# EAGLE design UPbrdEDP (EAGLE 8.6.0)
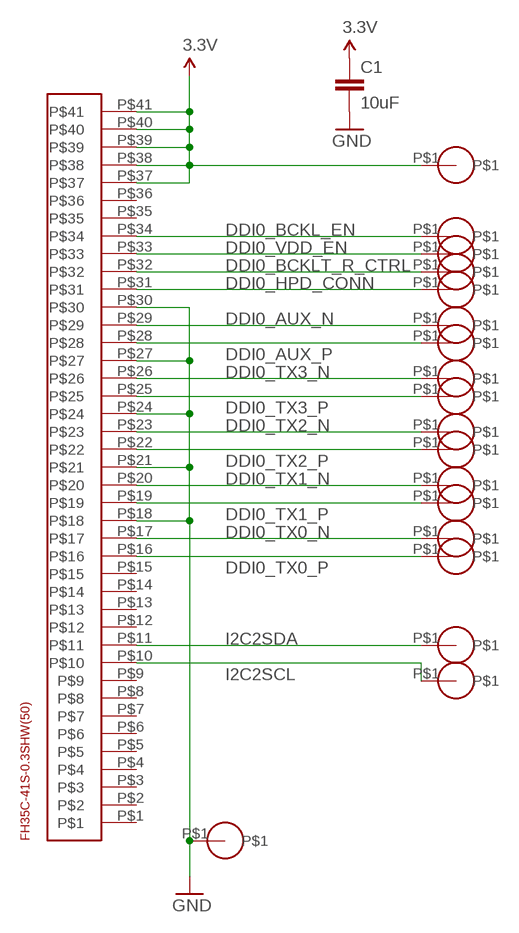
[diagram p0: schematic, sheet 1]

## Parts
C1  10uF  10UF-6.3V-20%(0603)  [0603-CAP]
U$1  FH35C-41S-0.3SHW(50)  [FH35C-41S-0.3SHW(50)]
U$2  SOLDERPAD  [SOLDERPAD]
U$3  SOLDERPAD  [SOLDERPAD]
U$4  SOLDERPAD  [SOLDERPAD]
U$5  SOLDERPAD  [SOLDERPAD]
U$6  SOLDERPAD  [SOLDERPAD]
U$7  SOLDERPAD  [SOLDERPAD]
U$8  SOLDERPAD  [SOLDERPAD]
U$9  SOLDERPAD  [SOLDERPAD]
U$10  SOLDERPAD  [SOLDERPAD]
U$11  SOLDERPAD  [SOLDERPAD]
U$12  SOLDERPAD  [SOLDERPAD]
U$13  SOLDERPAD  [SOLDERPAD]
U$14  SOLDERPAD  [SOLDERPAD]
U$15  SOLDERPAD  [SOLDERPAD]
U$16  SOLDERPAD  [SOLDERPAD]
U$17  SOLDERPAD  [SOLDERPAD]
U$18  SOLDERPAD  [SOLDERPAD]
U$19  SOLDERPAD  [SOLDERPAD]

## Nets
3.3V: C1.1 U$1.P$37 U$1.P$38 U$1.P$39 U$1.P$40 U$1.P$41 U$18.P$1
DDI0_AUX_N: U$1.P$29 U$13.P$1
DDI0_AUX_P: U$1.P$28 U$12.P$1
DDI0_BCKL_EN: U$1.P$34 U$17.P$1
DDI0_BCKLT_R_CTRL: U$1.P$32 U$15.P$1
DDI0_HPD_CONN: U$1.P$31 U$14.P$1
DDI0_TX0_N: U$1.P$17 U$5.P$1
DDI0_TX0_P: U$1.P$16 U$4.P$1
DDI0_TX1_N: U$1.P$20 U$7.P$1
DDI0_TX1_P: U$1.P$19 U$6.P$1
DDI0_TX2_N: U$1.P$23 U$9.P$1
DDI0_TX2_P: U$1.P$22 U$8.P$1
DDI0_TX3_N: U$1.P$26 U$11.P$1
DDI0_TX3_P: U$1.P$25 U$10.P$1
DDI0_VDD_EN: U$1.P$33 U$16.P$1
GND: C1.2 U$1.P$18 U$1.P$21 U$1.P$24 U$1.P$27 U$1.P$30 U$19.P$1
I2C2SCL: U$1.P$10 U$3.P$1
I2C2SDA: U$1.P$11 U$2.P$1
Unconnected: U$1.P$1 U$1.P$2 U$1.P$3 U$1.P$4 U$1.P$5 U$1.P$6 U$1.P$7 U$1.P$8 U$1.P$9 U$1.P$12 U$1.P$13 U$1.P$14 U$1.P$15 U$1.P$35 U$1.P$36

## Library data of the parts
C1 = SparkFun-Capacitors:10UF-6.3V-20%(0603): CAP-11015; PROD_ID: CAP-11015
U$1 = FH35C-41S-0.3SHW(50):FH35C-41S-0.3SHW(50)
U$2-U$19 = solderpad:SOLDERPAD

## Net classes
0 TX0: width 0.154 mm

## Board
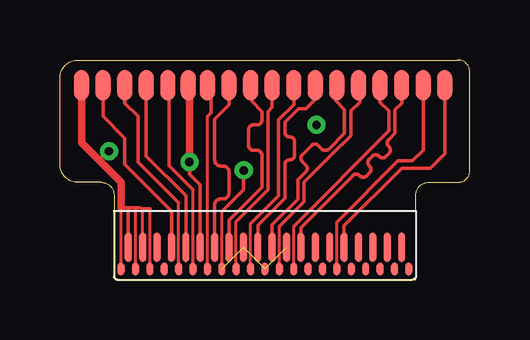
[diagram p1: board, top side]
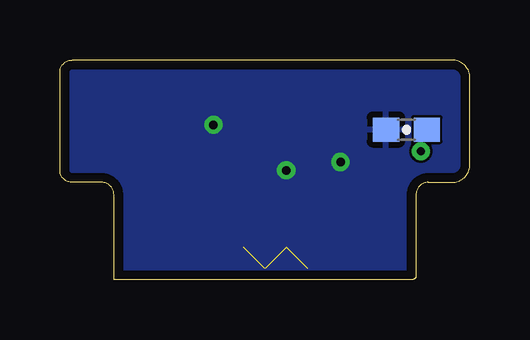
[diagram p2: board, bottom side, seen from below]

Size 17.1 x 9.15 mm. Coordinates in mm from the lower left corner, seen from the top.
Outline: 1.74,4.05 0.75,4.05 arc-90 0,4.8 0,8.4 arc-90 0.75,9.15 16.59,9.15 arc-90 17.1,8.64 17.1,4.56 arc-90 16.59,4.05 15.36,4.05 arc90 14.85,3.54 14.85,0 2.4,0 arc-90 2.25,0.15 2.25,3.54 arc90 1.74,4.05
Copper layers (1*16): Top 0.035mm / dielectric 1.5mm / Bottom 0.035mm
Design rules "default *": minimum track width 6mil, minimum drill 0.35mm, track to track 4mil, track to pad 6mil, pad to pad 6mil, via to via 6mil, smd to smd 6mil, copper to edge 15mil, drill to drill 6mil, minimum pad ring 10mil, minimum via ring 8mil, stop-mask expansion 1.5mil, vias tented up to drill 20mil, thermal gap 10mil

### Footprints (pad centres in the part's own frame; a part is rotated, then mirrored left to right if it is on the bottom)
0603-CAP = smd 1.1 x 1: 1 -0.85,0; 2 0.85,0
FH35C-41S-0.3SHW(50) = smd 0.3 x 0.55: P$1 0.3,2.4; P$3 0.9,2.4; P$5 1.5,2.4; P$7 2.1,2.4; P$9 2.7,2.4; P$11 3.3,2.4; P$13 3.9,2.4; P$15 4.5,2.4; P$17 5.1,2.4; P$19 5.7,2.4; P$21 6.3,2.4; P$23 6.9,2.4; P$25 7.5,2.4; P$27 8.1,2.4; P$29 8.7,2.4; P$31 9.3,2.4; P$33 9.9,2.4; P$35 10.5,2.4; P$37 11.1,2.4; P$39 11.7,2.4; P$41 12.3,2.4 | smd 0.3 x 1.25: P$2 0.6,1.5; P$4 1.2,1.5; P$6 1.8,1.5; P$8 2.4,1.5; P$10 3,1.5; P$12 3.6,1.5; P$14 4.2,1.5; P$16 4.8,1.5; P$18 5.4,1.5; P$20 6,1.5; P$22 6.6,1.5; P$24 7.2,1.5; P$26 7.8,1.5; P$28 8.4,1.5; P$30 9,1.5; P$32 9.6,1.5; P$34 10.2,1.5; P$36 10.8,1.5; P$38 11.4,1.5; P$40 12,1.5
SOLDERPAD = smd 0.635 x 1.27: P$1 0,0

### Placement (x,y rotation side)
C1  2.65,6.25 180 bottom
U$1  14.85,2.85 180 top
U$2  15.15,8.1 0 top
U$3  16.05,8.1 0 top
U$4  14.25,8.1 0 top
U$5  13.35,8.1 0 top
U$6  12.45,8.1 0 top
U$7  11.55,8.1 0 top
U$8  10.65,8.1 0 top
U$9  9.75,8.1 0 top
U$10  8.85,8.1 0 top
U$11  7.95,8.1 0 top
U$12  7.05,8.1 0 top
U$13  6.15,8.1 0 top
U$14  4.5,8.1 0 top
U$15  3.6,8.1 0 top
U$16  2.7,8.1 0 top
U$17  1.8,8.1 0 top
U$18  0.9,8.1 0 top
U$19  5.35,8.1 0 top

### Tracks (layer width: path | path; a pad name or v marks a point on that pad's centre or on a via)
3.3V  (via drill 0.35)
  Top 0.127: U$1.P$39 3.15,3 | U$1.P$38 3.45,2.89 | U$1.P$37 3.75,2.95 | U$1.P$41 2.55,3
  Top 0.152: 2.85,3 U$1.P$40 | 2.85,3 3.15,3 3.34,3 3.4,2.95 | 3.45,2.89 3.4,2.95 | 3.75,2.95 3.4,2.95 | 2.55,3 2.85,3 | 1.55,5.05 1.7,5.05 2,5.35 v2.05,5.35
  Top 0.305: 2.55,3 2.55,4.05 1.55,5.05 0.9,5.7 U$18.P$1
  Bottom 0.152: v2.05,5.35 2.05,6 C1.1
DDI0_AUX_N
  Top 0.127: U$1.P$29 6.15,6.82
  Top 0.152: 6.15,6.82 6.29,6.96 6.29,7.96 U$13.P$1
DDI0_AUX_P
  Top 0.152: U$1.P$28 6.45,3.1 arc-90 6.71,3.36 6.8,3.36 arc90 7.06,3.62 7.06,4.47 arc90 6.8,4.73 6.71,4.73 arc-90 6.45,4.99 6.45,6.68 7.05,7.28 U$12.P$1
DDI0_BCKL_EN
  Top 0.152: U$1.P$34 4.65,2.85 2.7,4.8 2.7,5.9 1.8,6.8 U$17.P$1
DDI0_BCKLT_R_CTRL
  Top 0.152: U$1.P$32 5.25,3.5 3.6,5.15 U$15.P$1
DDI0_HPD_CONN
  Top 0.127: U$1.P$31 5.55,3.75
  Top 0.152: 5.55,3.75 4.55,4.75 4.55,8.05 U$14.P$1
DDI0_TX0_N
  Top 0.127: U$1.P$17 9.75,2.23
  Top 0.154: 9.75,2.23 13.72,6.2 13.72,7.03 13.35,7.4 U$5.P$1
DDI0_TX0_P
  Top 0.154: U$1.P$16 10.05,2.17 12.21,4.33 arc-90 12.5,4.33 12.51,4.33 arc90 12.79,4.33 12.91,4.44 arc90 12.91,4.73 12.91,4.74 arc-90 12.91,5.03 13.02,5.14 arc-90 13.31,5.14 13.31,5.14 arc90 13.6,5.14 13.72,5.25 arc90 13.72,5.54 13.71,5.55 arc-90 13.71,5.83 13.98,6.1 13.98,7.08 14.25,7.35 U$4.P$1
DDI0_TX1_N
  Top 0.152: U$1.P$20 8.85,2.28 9.92,3.35 9.92,4.15 10.26,4.49 arc90 10.26,4.77 10.11,4.92 arc-90 10.11,5.21 10.49,5.59 arc-90 10.78,5.59 10.92,5.44 arc90 11.21,5.44 11.87,6.1 11.87,7.08 11.5,7.45 11.5,8.05 U$7.P$1
DDI0_TX1_P
  Top 0.127: U$1.P$19 9.15,2.22
  Top 0.152: 9.15,2.22 10.18,3.25 10.18,4.05 10.44,4.31 11.39,5.26 12.13,6 12.13,7.03 12.5,7.4 12.5,8.05 U$6.P$1
DDI0_TX2_N
  Top 0.127: U$1.P$23 7.95,2.33
  Top 0.154: 7.95,2.33 9.12,3.5 9.12,6.65 9.76,7.29 U$9.P$1
DDI0_TX2_P
  Top 0.154: U$1.P$22 8.25,2.27 9.38,3.4 9.38,4.79 arc-90 9.58,4.99 arc90 9.79,5.19 9.79,5.74 arc90 9.58,5.95 arc-90 9.38,6.15 9.38,6.55 9.94,7.11 10.26,7.11 10.7,7.55 10.7,8.05 U$8.P$1
DDI0_TX3_N
  Top 0.154: U$1.P$26 7.05,2.48 8.42,3.85 8.42,5.18 arc90 8.22,5.39 8.07,5.39 arc-90 7.87,5.59 7.87,6.24 arc-90 8.07,6.45 8.22,6.45 arc90 8.42,6.65 8.42,7 8,7.42 8,7.55 7.95,7.6 U$11.P$1
DDI0_TX3_P
  Top 0.127: U$1.P$25 7.35,2.42
  Top 0.154: 7.35,2.42 8.68,3.75 8.68,7 8.85,7.17 U$10.P$1
DDI0_VDD_EN
  Top 0.127: U$1.P$33 4.95,3.2
  Top 0.152: U$16.P$1 2.7,7.35 3.25,6.8 3.25,4.9 4.95,3.2
GND  (via drill 0.35)  (3 unrouted)
  Top 0.127: U$1.P$27 6.75,2.85
  Top 0.152: v5.4,4.9 5.4,4.4 5.85,3.95 U$1.P$30
  Top 0.154: 6.75,2.85 7.65,3.75 7.65,4.55 v7.67,4.55
  Top 0.305: U$19.P$1 5.4,8.05 v5.4,4.9
  other vias: 10.7,6.45
  pour Bottom: -0.6,9.6 -0.6,-0.75 17.85,-0.75 17.85,9.6
I2C2SCL
  Top 0.152: U$1.P$10 11.85,2.25 14.25,4.65 15.45,4.65 16.05,5.25 U$3.P$1
I2C2SDA
  Top 0.127: U$1.P$11 11.55,2.4
  Top 0.152: 11.55,2.4 14.1,4.95 14.7,4.95 15.15,5.4 U$2.P$1